# Altium project WGPIB.PrjPCB
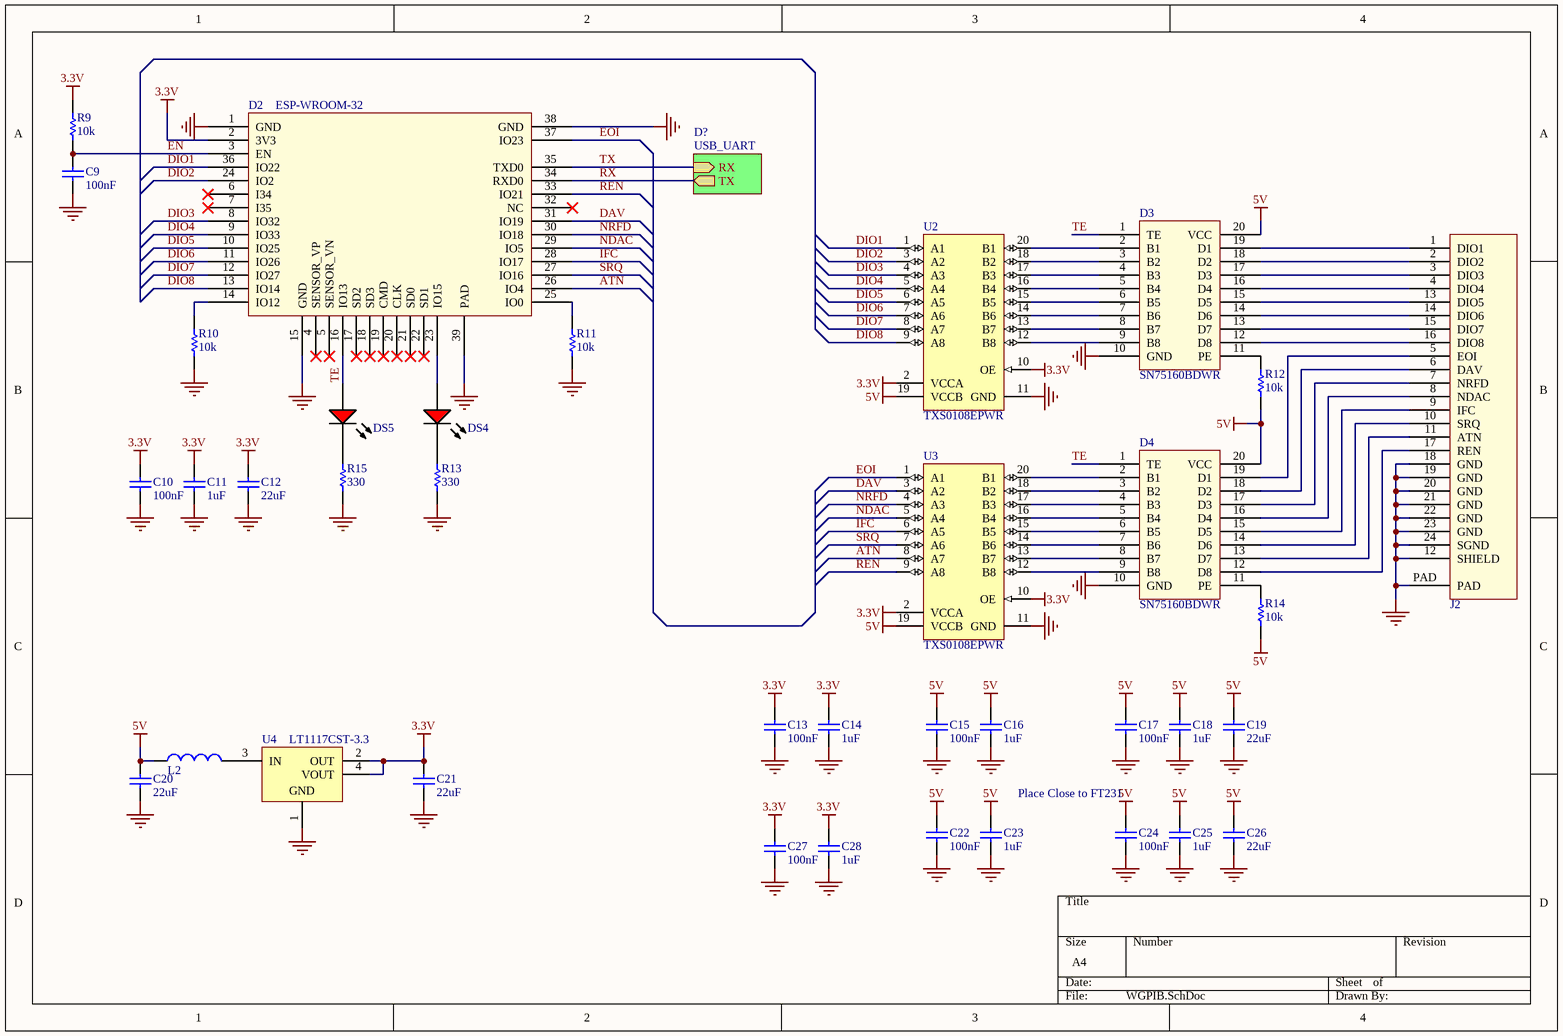
[diagram p0: WGPIB.SchDoc]
2 sheets, 60 parts. Net scope: hierarchical (ports join the sheet entries above them; power ports are global).
Board file: WGPIB.PcbDoc
Sheets:
  WGPIB.SchDoc
    D? = USB_UART.SchDoc

## Sheet WGPIB.SchDoc
size A4

### Parts
C9  100nF  [CAPC0805(2012)145_N]
C10  100nF  [CAPC0805(2012)145_N]
C11  1uF  [CAPC0805(2012)145_N]
C12  22uF  [CAPC1206(3216)190_M]
C13  100nF  [CAPC0805(2012)145_N]
C14  1uF  [CAPC0805(2012)145_N]
C15  100nF  [CAPC0805(2012)145_N]
C16  1uF  [CAPC0805(2012)145_N]
C17  100nF  [CAPC0805(2012)145_N]
C18  1uF  [CAPC0805(2012)145_N]
C19  22uF  [CAPC1206(3216)190_M]
C20  22uF  [CAPC1206(3216)190_M]
C21  22uF  [CAPC1206(3216)190_M]
C22  100nF  [CAPC0805(2012)145_N]
C23  1uF  [CAPC0805(2012)145_N]
C24  100nF  [CAPC0805(2012)145_N]
C25  1uF  [CAPC0805(2012)145_N]
C26  22uF  [CAPC1206(3216)190_M]
C27  100nF  [CAPC0805(2012)145_N]
C28  1uF  [CAPC0805(2012)145_N]
D2  ESP-WROOM-32  [ESP-WROOM-32]
D3  SN75160BDWR  [SOIC-20]
D4  SN75160BDWR  [SOIC-20]
DS4  TLMS1100-GS08  [VISH-TLMX1100_V]  (value not drawn)
DS5  TLMS1100-GS08  [VISH-TLMX1100_V]  (value not drawn)
J2  GPIB  [GPIB THT]  (value not drawn)
L2  FBMJ2125HM210NT  [INDC2013X105X50LL20T30]  (value not drawn)
R9  10k  [RESC0805(2012)_M]
R10  10k  [RESC0805(2012)_M]
R11  10k  [RESC0805(2012)_M]
R12  10k  [RESC0805(2012)_M]
R13  330  [RESC0805(2012)_M]
R14  10k  [RESC0805(2012)_M]
R15  330  [RESC0805(2012)_M]
U2  TXS0108EPWR  [PW0020A_M]
U3  TXS0108EPWR  [PW0020A_M]
U4  LT1117CST-3.3  [LT-ST-3-SOT-223_M]

### Sub-sheets
D? = USB_UART: RX (in), TX (out)

### Nets
3.3V: C10.2 C11.2 C12.2 C13.2 C14.2 C21.2 C27.2 C28.2 D2.2(3V3) R9.2 U2.2(VCCA) U2.10(OE) U3.2(VCCA) U3.10(OE) U4.2(OUT) U4.4(VOUT)
5V: C15.2 C16.2 C17.2 C18.2 C19.2 C20.2 C22.2 C23.2 C24.2 C25.2 C26.2 D3.20(VCC) D4.20(VCC) L2.1 R12.1 R14.1 U2.19(VCCB) U3.19(VCCB)
GND: C9.1 C10.1 C11.1 C12.1 C13.1 C14.1 C15.1 C16.1 C17.1 C18.1 C19.1 C20.1 C21.1 C22.1 C23.1 C24.1 C25.1 C26.1 C27.1 C28.1 D2.1(GND) D2.15(GND) D2.38(GND) D2.39(PAD) D3.10(GND) D4.10(GND) J2.12(SHIELD) J2.18(GND) J2.19(GND) J2.20(GND) J2.21(GND) J2.22(GND) J2.23(GND) J2.24(SGND) J2.PAD R10.1 R11.1 R13.1 R15.1 U2.11(GND) U3.11(GND) U4.1(GND)
ATN: D2.26(IO4) U3.8(A7)
DAV: D2.31(IO19) U3.3(A2)
DIO1: D2.36(IO22) U2.1(A1)
DIO2: D2.24(IO2) U2.3(A2)
DIO3: D2.8(IO32) U2.4(A3)
DIO4: D2.9(IO33) U2.5(A4)
DIO5: D2.10(IO25) U2.6(A5)
DIO6: D2.11(IO26) U2.7(A6)
DIO7: D2.12(IO27) U2.8(A7)
DIO8: D2.13(IO14) U2.9(A8)
EN: C9.2 D2.3(EN) R9.1
EOI: D2.37(IO23) U3.1(A1)
IFC: D2.28(IO17) U3.6(A5)
NDAC: D2.29(IO5) U3.5(A4)
NRFD: D2.30(IO18) U3.4(A3)
REN: D2.33(IO21) U3.9(A8)
RX: D2.34(RXD0) ; sheet D?/TX
SRQ: D2.27(IO16) U3.7(A6)
TE: D2.16(IO13) D3.1(TE) D4.1(TE) DS5.1(A)
TX: D2.35(TXD0) ; sheet D?/RX
NetD2_14: D2.14(IO12) R10.2
NetD2_23: D2.23(IO15) DS4.1(A)
NetD2_25: D2.25(IO0) R11.2
NetD3_2: D3.2(B1) U2.20(B1)
NetD3_3: D3.3(B2) U2.18(B2)
NetD3_4: D3.4(B3) U2.17(B3)
NetD3_5: D3.5(B4) U2.16(B4)
NetD3_6: D3.6(B5) U2.15(B5)
NetD3_7: D3.7(B6) U2.14(B6)
NetD3_8: D3.8(B7) U2.13(B7)
NetD3_9: D3.9(B8) U2.12(B8)
NetD3_11: D3.11(PE) R12.2
NetD3_12: D3.12(D8) J2.16(DIO8)
NetD3_13: D3.13(D7) J2.15(DIO7)
NetD3_14: D3.14(D6) J2.14(DIO6)
NetD3_15: D3.15(D5) J2.13(DIO5)
NetD3_16: D3.16(D4) J2.4(DIO4)
NetD3_17: D3.17(D3) J2.3(DIO3)
NetD3_18: D3.18(D2) J2.2(DIO2)
NetD3_19: D3.19(D1) J2.1(DIO1)
NetD4_2: D4.2(B1) U3.20(B1)
NetD4_3: D4.3(B2) U3.18(B2)
NetD4_4: D4.4(B3) U3.17(B3)
NetD4_5: D4.5(B4) U3.16(B4)
NetD4_6: D4.6(B5) U3.15(B5)
NetD4_7: D4.7(B6) U3.14(B6)
NetD4_8: D4.8(B7) U3.13(B7)
NetD4_9: D4.9(B8) U3.12(B8)
NetD4_11: D4.11(PE) R14.2
NetD4_12: D4.12(D8) J2.17(REN)
NetD4_13: D4.13(D7) J2.11(ATN)
NetD4_14: D4.14(D6) J2.10(SRQ)
NetD4_15: D4.15(D5) J2.9(IFC)
NetD4_16: D4.16(D4) J2.8(NDAC)
NetD4_17: D4.17(D3) J2.7(NRFD)
NetD4_18: D4.18(D2) J2.6(DAV)
NetD4_19: D4.19(D1) J2.5(EOI)
NetDS4_2: DS4.2(K) R13.2
NetDS5_2: DS5.2(K) R15.2
NetL2_2: L2.2 U4.3(IN)

Not connected (* = marked no-connect by the designer): D2 4(SENSOR_VP)* 5(SENSOR_VN)* 6(I34)* 7(I35)* 17(SD2)* 18(SD3)* 19(CMD)* 20(CLK)* 21(SD0)* 22(SD1)* 32(NC)*

### Notes on the sheet
- Place Close to FT231

### Library data of the parts
C9 C10 C13 C15 C17 C22 C24 C27 = CMP-1036-04431-1: Case-Metric: 2012; Rated Voltage: 100 V; Tolerance: Â±20%; Case-EIA: 0805; Value: 100nF; Technology: SMT; Max Thickness: 1.45 mm
C11 C14 C16 C18 C23 C25 C28 = CMP-1036-04431-1: Case-Metric: 2012; Value: 100nF; Rated Voltage: 100 V; Tolerance: Â±20%; Case-EIA: 0805; Technology: SMT; Max Thickness: 1.45 mm
C12 C19-C21 C26 = CMP-1037-04993-1: Tolerance: Â±20%; Rated Voltage: 16 V; Case-Metric: 3216; Case-EIA: 1206; Value: 22uF; Technology: SMT; Max Thickness: 1.9 mm
D2 = ESP-WROOM-32: ESP32 Module
DS4 DS5 = CMP-1666-00027-1: LED, RED, 2.1 V, -40 to 100 degC, 2-Pin SMD (0603), RoHS, Tape and Reel; Type (Capacitors): C0G; Resistance: 100000000000 Ohm; Capacitance: 12 pF; Voltage Rating: 50 V; Tolerance: 5%; Min Operating Temperature: -55degC; REACH SVHC: No SVHC; ComponentLink2Description: Datasheet; ComponentLink1URL: http://www.vishay.com/; Width: 0.8 mm; Package Quantity: 4000; PackageReference: TLMX1100; ComponentLink2URL: http://www.vishay.com/docs/83173/tlmb1100.pdf; Case/Package: 0603; Case Code (Metric): 1608; Packaging: Tape and Reel; Pins: 2; ComponentLink1Description: Manufacturer URL; Max Operating Temperature: 125degC; Height: 0.8 mm; Length: 1.6 mm; Mount: Surface Mount; PackageDescription: 2-Pin Surface Mount Device, Body 1.6 x 0.8 mm; DatasheetVersion: Rev. 2.7, 03/2016; Case Code (Imperial): 0603; Voltage Rating (DC): 50 V; RoHSCompliant: True; Radiation Hardening: No
J2 = GPIB: 112-024-113R001
L2 = CMP-1660-00003-1: Chip Inductor, 21 Ohm, +/- 30%, 6 A, -40 to 125 degC, 0805 (2012 Metric), RoHS, Tape and Reel; Core Material: Ferrite; Current Rating: 6 A; Resistance: 4 mohm; Case\Package: 0805; Impedance: 21 Ohm; Min Operating Temperature: -40 degC; Width: 1.25 mm; PackageDescription: 2-Pin Surface Mount Device, Body 2 x 1.25 mm; Mounting Technology: Surface Mount; Package Quantity: 1; DatasheetVersion: 08/2016; Tolerance: 30%; Mount: Surface Mount; Max Operating Temperature: 125 degC; Height: 0.85 mm; ComponentLink1URL: http://www.t-yuden.com/; Case Code (Metric): 2012; ComponentLink1Description: Manufacturer URL; ComponentLink2URL: http://ds.yuden.co.jp/TYCOMPAS/ut/detail.do?productNo=FBMJ2125HM210NT&fileName=FBMJ2125HM210NT_SS&mode=specSheetDownload; Case Code (Imperial): 0805; Packaging: Tape and Reel; ComponentLink2Description: Datasheet; PackageReference: 0805; RoHSCompliant: true; Max Current Rating: 6 A; Length: 2 mm; REACH SVHC: Unknown
R9-R15 = CMP-1013-00038-1: Power: 0.125 W; Case-Metric: 2012; Case-EIA: 0805; Tolerance: 5 %; Value: 33.00 Ohm; Technology: SMT
U2 U3 = CMP-2000-04956-1: Bidirectional Voltage-Level Translator for Open-Drain and Push-Pull Application, 8 bit, 1.2 to 3.6 V, -40 to 85 degC, 20-Pin TSSOP, Green (RoHS & no Sb/Br), Tape and Reel; Manufacturer: Texas Instruments; Logic Type: VoltageLevelTranslator; Output Current: 620µA; Propagation Delay: 4.8ns; Supply Voltage Min: 1.2V; No. of Inputs: 8; Supply Voltage Max: 5.5V; SVHC: NoSVHC(16-Jun-2014); No. of Pins: 20; Datasheet URL: https://datasheet.ciiva.com/14287/txs0108e-14287280.pdf; Operating Temperature Min: -40degC; Logic Case Style: TSSOP; Packaging: CutTape; Datasheet Version: Rev. B, 09/2008; MSL: MSL1-Unlimited; Manufacturer URL: http://www.ti.com/; Operating Temperature Max: 85degC
U4 = CMP-0476-01817-1: 0.8 A Low Dropout Positive Regulator, 2.45 to 15 V Vin, 3.3 V Vout, 3-pin SOT223 (ST-3), 0 to 125 degC; Manufacturer: Linear Technology; Isupply(mA): 5; PSRR(dB): 75; Dropout Voltage(V): 1.1; Output Voltage: 3.3 V; Vin Max(V): 15; Iout(mA): 800; Number of Outputs: 1; Discrete Pass Element: no; Vin Min(V): 2.45; PartNumber: LT1117CST-3.3; ComponentLink3URL: http://cds.linear.com/docs/en/packaging/SOT_3_05-08-1630.pdf; PackageDescription: 3-Pin Plastic SOT-223, 3.505 x 6.505 mm Body, Pitch 2.3 mm; ComponentLink3Description: Package Specification; ComponentLink2Description: Datasheet; ComponentLink2URL: http://cds.linear.com/docs/en/datasheet/1117fd.pdf; PackageReference: ST-3; RoHS: FALSE; ComponentLink1Description: Manufacturer URL; Mounting Technology: Surface Mount; ComponentLink1URL: http://www.linear.com/; DatasheetVersion: Rev. D; PackageVersion: Jun-10

## Sheet USB_UART.SchDoc
size A4
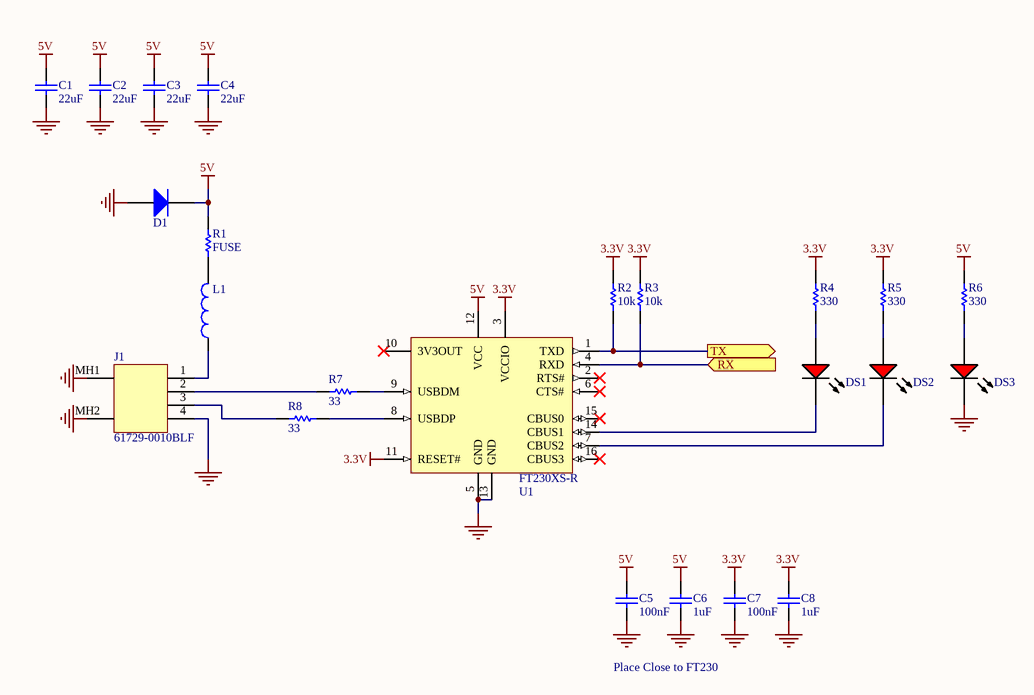
[diagram p1: USB_UART.SchDoc]

### Parts
C1  22uF  [CAPC1206(3216)190_M]
C2  22uF  [CAPC1206(3216)190_M]
C3  22uF  [CAPC1206(3216)190_M]
C4  22uF  [CAPC1206(3216)190_M]
C5  100nF  [CAPC0805(2012)145_N]
C6  1uF  [CAPC0805(2012)145_N]
C7  100nF  [CAPC0805(2012)145_N]
C8  1uF  [CAPC0805(2012)145_N]
D1  MMSD4148T3G  [ONSC-SOD123-2-425G-04_V]  (value not drawn)
DS1  TLMS1100-GS08  [VISH-TLMX1100_V]  (value not drawn)
DS2  TLMS1100-GS08  [VISH-TLMX1100_V]  (value not drawn)
DS3  TLMS1100-GS08  [VISH-TLMX1100_V]  (value not drawn)
J1  61729-0010BLF  [FCI-61729-0010BLF-6_V]
L1  FBMJ2125HM210NT  [INDC2013X105X50LL20T30]  (value not drawn)
R1  FUSE  [RESC0805(2012)_M]
R2  10k  [RESC0805(2012)_M]
R3  10k  [RESC0805(2012)_M]
R4  330  [RESC0805(2012)_M]
R5  330  [RESC0805(2012)_M]
R6  330  [RESC0805(2012)_M]
R7  33  [RESC0805(2012)_M]
R8  33  [RESC0805(2012)_M]
U1  FT230XS-R  [SSOP-16_M]

### Ports
RX (in), TX (out)

### Nets
3.3V: C7.2 C8.2 R2.2 R3.2 R4.2 R5.2 U1.3(VCCIO) U1.11(RESET#)
5V: C1.2 C2.2 C3.2 C4.2 C5.2 C6.2 D1.1(CATHODE) R1.2 R6.2 U1.12(VCC)
GND: C1.1 C2.1 C3.1 C4.1 C5.1 C6.1 C7.1 C8.1 D1.2(ANODE) DS3.2(K) J1.4 J1.MH1 J1.MH2 U1.5(GND) U1.13(GND)
RX: R2.1 U1.1(TXD) ; port TX
TX: R3.1 U1.4(RXD) ; port RX
NetDS1_1: DS1.1(A) R4.1
NetDS1_2: DS1.2(K) U1.14(CBUS1)
NetDS2_1: DS2.1(A) R5.1
NetDS2_2: DS2.2(K) U1.7(CBUS2)
NetDS3_1: DS3.1(A) R6.1
NetJ1_1: J1.1 L1.1
NetJ1_2: J1.2 R7.1
NetJ1_3: J1.3 R8.1
NetL1_2: L1.2 R1.1
NetR7_2: R7.2 U1.9(USBDM)
NetR8_2: R8.2 U1.8(USBDP)

Not connected (* = marked no-connect by the designer): U1 2(RTS#)* 6(CTS#)* 10(3V3OUT)* 15(CBUS0)* 16(CBUS3)*

### Notes on the sheet
- Place Close to FT230

### Library data of the parts
C1-C4 = CMP-1037-04993-1: as C12 on sheet WGPIB; Value: 22uF; Technology: SMT; Max Thickness: 1.9 mm
C5 C7 = CMP-1036-04431-1: as C9 on sheet WGPIB; Value: 100nF; Technology: SMT; Max Thickness: 1.45 mm
C6 C8 = CMP-1036-04431-1: as C11 on sheet WGPIB; Technology: SMT; Max Thickness: 1.45 mm
D1 = CMP-0895-00002-1: Manufacturer: ON Semiconductor; CD (Max): 4 pF; IR @ VR: 75 V (Max)=50 uA; PD (Max): 425 mW; VF (Max): 1 A; Trr (Max): 4 ns; Packing: Tape and Reel; VBR (Min): 100 V; ComponentLink1URL: http://www.onsemi.com/; ComponentLink1Description: Manufacturer URL; PackageReference: SOD123-2-425G-04; PackageDescription: 2-Pin SOD123, Body 2.69 x 1.6 mm, Height 1.35 mm; ComponentLink2Description: Datasheet; Mounting Technology: Surface Mount; RoHS: TRUE; PartNumber: MMSD4148T3G; PackageVersion: Rev. 04G; DatasheetVersion: Rev. 11; Temperature Range: -55 to 150 degC; ComponentLink3Description: Package Specification; ComponentLink3URL: http://www.onsemi.com/pub_link/Collateral/425-04.PDF; ComponentLink2URL: http://www.onsemi.com/pub_link/Collateral/MMSD4148T1-D.PDF
DS1-DS3 = CMP-1666-00027-1: as DS4 on sheet WGPIB; Min Operating Temperature: -55degC; REACH SVHC: No SVHC; ComponentLink2Description: Datasheet; ComponentLink1URL: http://www.vishay.com/; Width: 0.8 mm; Package Quantity: 4000; PackageReference: TLMX1100; ComponentLink2URL: http://www.vishay.com/docs/83173/tlmb1100.pdf; Case/Package: 0603; Case Code (Metric): 1608; Packaging: Tape and Reel; Pins: 2; ComponentLink1Description: Manufacturer URL; Max Operating Temperature: 125degC; Height: 0.8 mm; Length: 1.6 mm; Mount: Surface Mount; PackageDescription: 2-Pin Surface Mount Device, Body 1.6 x 0.8 mm; DatasheetVersion: Rev. 2.7, 03/2016; Case Code (Imperial): 0603; Voltage Rating (DC): 50 V; RoHSCompliant: True; Radiation Hardening: No
J1 = CMP-0397-00002-2: Single USB 2.0, B Type, Right Angle Jack, Through Hole, RoHS, Tube; Manufacturer: FCI Electronics; Number of Contacts: 4; Gender: Receptacle; Specifications: USB 2.0; Connector Type: USB-B; ComponentLink1URL: http://portal.fciconnect.com/; DatasheetVersion: Rev. V; PartNumber: 61729-0010BLF; ComponentLink3Description: Package Specification; PackageDescription: 6-Pin, Through Hole, Body 12.2 x 16 mm; Packing: Tube; ComponentLink2Description: Datasheet; Mounting Technology: Through Hole; PackageReference: 61729-0010BLF; ComponentLink1Description: Manufacturer URL; ComponentLink3URL: http://portal.fciconnect.com/Comergent//fci/drawing/61729.pdf; ComponentLink2URL: http://portal.fciconnect.com/Comergent//fci/drawing/61729.pdf; RoHS: TRUE
L1 = CMP-1660-00003-1: as L2 on sheet WGPIB; Min Operating Temperature: -40 degC; Width: 1.25 mm; PackageDescription: 2-Pin Surface Mount Device, Body 2 x 1.25 mm; Mounting Technology: Surface Mount; Package Quantity: 1; DatasheetVersion: 08/2016; Tolerance: 30%; Mount: Surface Mount; Max Operating Temperature: 125 degC; Height: 0.85 mm; ComponentLink1URL: http://www.t-yuden.com/; Case Code (Metric): 2012; ComponentLink1Description: Manufacturer URL; ComponentLink2URL: http://ds.yuden.co.jp/TYCOMPAS/ut/detail.do?productNo=FBMJ2125HM210NT&fileName=FBMJ2125HM210NT_SS&mode=specSheetDownload; Case Code (Imperial): 0805; Packaging: Tape and Reel; ComponentLink2Description: Datasheet; PackageReference: 0805; RoHSCompliant: true; Max Current Rating: 6 A; Length: 2 mm; REACH SVHC: Unknown
R1-R8 = CMP-1013-00038-1: as R9 on sheet WGPIB; Technology: SMT
U1 = CMP-0248-00026-2: USB to Basic UART Interface Chip, UHCI/OHCI/EHCI Compatible, USB 2.0 Compatible, -40 to +85 degC, 16-Pin SSOP, Pb-Free, Tape and Reel; Manufacturer: FTDI; DatasheetVersion: ver 1.2, Feb-2013; PackageDescription: 16-Pin Small Outline Package, 8.6 x 3.9 mm Body, 0.635 mm Pitch; ComponentLink1Description: Manufacturer URL; ComponentLink2Description: Datasheet; ComponentLink2URL: http://www.ftdichip.com/Support/Documents/DataSheets/ICs/DS_FT230X.pdf; ComponentLink3URL: www.ftdichip.com/Products/ICs/FT230X.html; ComponentLink3Description: FT230X Product Page; PackageReference: SSOP-16; ComponentLink1URL: http://www.ftdichip.com/; PartNumber: FT230XS-R; RevisionNote: DatasheetVersion updated to 1.2 Feb-2013; Code_JEDEC: MO-137-AB; PackageVersion: Feb-13

## Nets that join several sheets
3.3V: WGPIB (16 pins), USB_UART (8 pins)
5V: WGPIB (18 pins), USB_UART (10 pins)
GND: WGPIB (42 pins), USB_UART (15 pins)
RX: WGPIB (D2.34), USB_UART (R2.1 U1.1)
TX: WGPIB (D2.35), USB_UART (R3.1 U1.4)